# EAGLE schematic drive_trifasico (EAGLE 7.1.0)
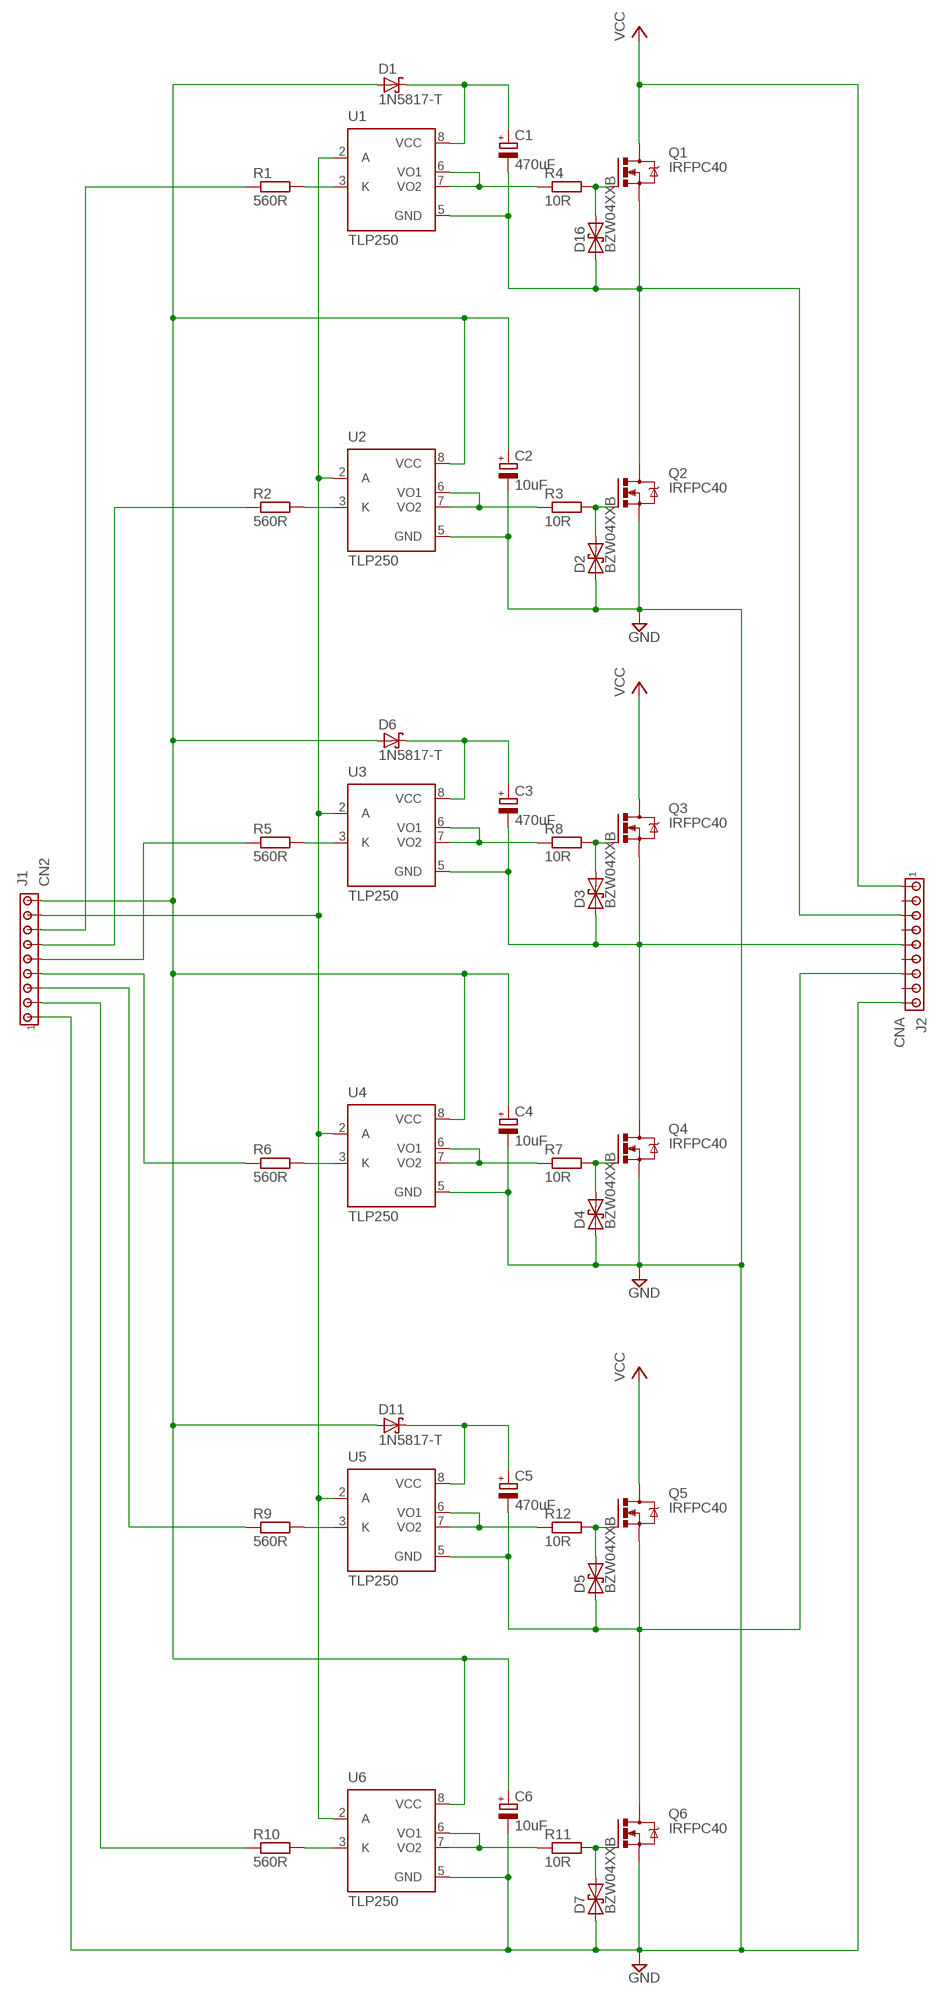
[diagram p0: schematic, sheet 1]

## Parts
C1  470uF  CPOL-EUE5-8.5  [E5-8,5]
C2  10uF  CPOL-EUE5-6  [E5-6]
C3  470uF  CPOL-EUE5-8.5  [E5-8,5]
C4  10uF  CPOL-EUE5-6  [E5-6]
C5  470uF  CPOL-EUE5-8.5  [E5-8,5]
C6  10uF  CPOL-EUE5-6  [E5-6]
D1  1N5817-T  [DO41-7.6]
D2  BZW04XXB  [F126Z12]
D3  BZW04XXB  [F126Z12]
D4  BZW04XXB  [F126Z12]
D5  BZW04XXB  [F126Z12]
D6  1N5817-T  [DO41-7.6]
D7  BZW04XXB  [F126Z12]
D11  1N5817-T  [DO41-7.6]
D16  BZW04XXB  [F126Z12]
J1  CN2  MTA09-100  [10X09MTA]
J2  CNA  MTA09-156  [1X9MTA]
Q1  IRFPC40  [TO247BV]
Q2  IRFPC40  [TO247BV]
Q3  IRFPC40  [TO247BV]
Q4  IRFPC40  [TO247BV]
Q5  IRFPC40  [TO247BV]
Q6  IRFPC40  [TO247BV]
R1  560R  R-EU_0207/12  [0207/12]
R2  560R  R-EU_0207/12  [0207/12]
R3  10R  R-EU_0207/12  [0207/12]
R4  10R  R-EU_0207/12  [0207/12]
R5  560R  R-EU_0207/12  [0207/12]
R6  560R  R-EU_0207/12  [0207/12]
R7  10R  R-EU_0207/12  [0207/12]
R8  10R  R-EU_0207/12  [0207/12]
R9  560R  R-EU_0207/12  [0207/12]
R10  560R  R-EU_0207/12  [0207/12]
R11  10R  R-EU_0207/12  [0207/12]
R12  10R  R-EU_0207/12  [0207/12]
U1  TLP250  [DIP08]
U2  TLP250  [DIP08]
U3  TLP250  [DIP08]
U4  TLP250  [DIP08]
U5  TLP250  [DIP08]
U6  TLP250  [DIP08]

## Nets
GND: C2.- C4.- C6.- D2.A D4.A D7.A J1.1 J2.9 Q2.S Q4.S Q6.S U2.5(GND) U4.5(GND) U6.5(GND)
N$1: R7.1 U4.6(VO1) U4.7(VO2)
N$2: D16.C Q1.G R4.2
N$3: R3.1 U2.6(VO1) U2.7(VO2)
N$4: R4.1 U1.6(VO1) U1.7(VO2)
N$5: C1.+ D1.C U1.8(VCC)
N$6: R1.2 U1.3(K)
N$7: J1.8 U1.2(A) U2.2(A) U3.2(A) U4.2(A) U5.2(A) U6.2(A)
N$8: R2.2 U2.3(K)
N$9: J1.7 R1.1
N$10: J1.6 R2.1
N$11: J1.5 R5.1
N$12: D2.C Q2.G R3.2
N$15: C1.- D16.A J2.3 Q1.S Q2.D U1.5(GND)
N$16: C3.+ D6.C U3.8(VCC)
N$17: J1.4 R6.1
N$18: R5.2 U3.3(K)
N$19: R6.2 U4.3(K)
N$20: J1.3 R9.1
N$21: J1.2 R10.1
N$23: R8.1 U3.6(VO1) U3.7(VO2)
N$24: D3.C Q3.G R8.2
N$25: D4.C Q4.G R7.2
N$28: C3.- D3.A J2.5 Q3.S Q4.D U3.5(GND)
N$29: R11.1 U6.6(VO1) U6.7(VO2)
N$30: C5.+ D11.C U5.8(VCC)
N$32: R9.2 U5.3(K)
N$33: R10.2 U6.3(K)
N$37: R12.1 U5.6(VO1) U5.7(VO2)
N$38: D5.C Q5.G R12.2
N$39: D7.C Q6.G R11.2
N$42: C5.- D5.A J2.7 Q5.S Q6.D U5.5(GND)
N$44: C2.+ C4.+ C6.+ D1.A D6.A D11.A J1.9 U2.8(VCC) U4.8(VCC) U6.8(VCC)
VCC: J2.1 Q1.D Q3.D Q5.D
Unconnected: J2.2 J2.4 J2.6 J2.8

## Library data of the parts
C1-C6 = rcl:CPOL-EU: POLARIZED CAPACITOR, European symbol
D1 D6 D11 = diode:1N581*: 1.0A SCHOTTKY BARRIER RECTIFIER Source: http://www.diodes.com/datasheets/ds23001.pdf
D2-D5 D7 D16 = diode:BZW04XXB: DIODE uni and bidirectional supressor diode
J1 = con-amp:MTA09-100: AMP connector
J2 = con-amp:MTA09-156: AMP connector
Q1-Q6 = transistor-power:IRFPC40: N-CHANNEL MOS FET
R1-R12 = rcl:R-EU_: RESISTOR, European symbol
U1-U6 = 0_Drive_trifasico:TLP250